# Altium schematic sheet power.SchDoc
size A4; DocumentNumber: 2; SheetNumber: 4; SheetTotal: 5
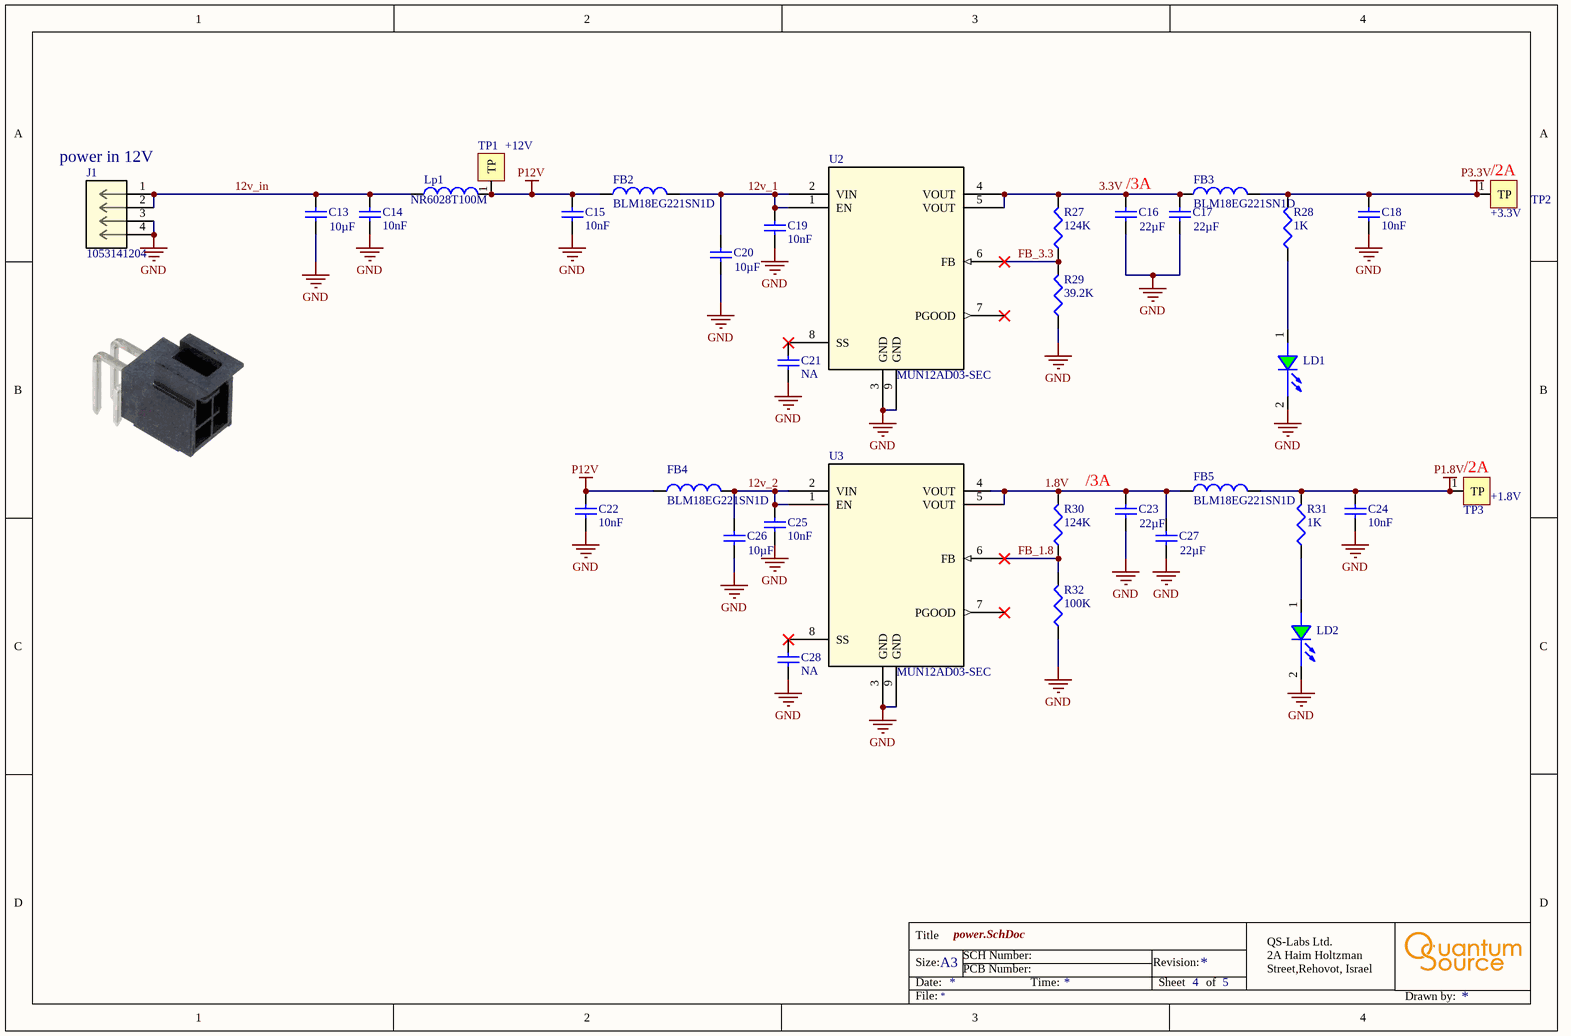
[diagram p0: power.SchDoc]

## Parts
C13  Capacitance: 10µF  [C0603]  (hidden comment: 10uF 25V)
C14  Capacitance: 10nF  [C0402]  (hidden comment: 10nF 25V)
C15  Capacitance: 10nF  [C0402]  (hidden comment: 10nF 25V)
C16  Capacitance: 22µF  [C0603]  (hidden comment: 22uF 16V)
C17  Capacitance: 22µF  [C0603]  (hidden comment: 22uF 16V)
C18  Capacitance: 10nF  [C0402]  (hidden comment: 10nF 25V)
C19  Capacitance: 10nF  [C0402]  (hidden comment: 10nF 25V)
C20  Capacitance: 10µF  [C0603]  (hidden comment: 10uF 25V)
C21  NA  [C0402]
C22  Capacitance: 10nF  [C0402]  (hidden comment: 10nF 25V)
C23  Capacitance: 22µF  [C0603]  (hidden comment: 22uF 16V)
C24  Capacitance: 10nF  [C0402]  (hidden comment: 10nF 25V)
C25  Capacitance: 10nF  [C0402]  (hidden comment: 10nF 25V)
C26  Capacitance: 10µF  [C0603]  (hidden comment: 10uF 25V)
C27  Capacitance: 22µF  [C0603]  (hidden comment: 22uF 16V)
C28  NA  [C0402]
FB2  BLM18EG221SN1D  [fb0603]
FB3  BLM18EG221SN1D  [FB0603]
FB4  BLM18EG221SN1D  [fb0603]
FB5  BLM18EG221SN1D  [fb0603]
J1  1053141204  [CON_1053141204]
LD1  APT1608SGC  [LED_0603_Green]  (value not drawn)
LD2  APT1608SGC  [LED_0603_Green]  (value not drawn)
Lp1  NR6028T100M  [ind6x6_H3]
R27  124K  [R0402]
R28  1K  [R0402]
R29  39.2K  [R0402]
R30  124K  [R0402]
R31  1K  [R0402]
R32  100K  [R0402]
TP1  +12V  [TP_2x1.8]
TP2  +3.3V  [TP_2x1.8]
TP3  +1.8V  [TP_2x1.8]
U2  MUN12AD03-SEC  [SO8_MUN12AD_DEA]
U3  MUN12AD03-SEC  [SO8_MUN12AD_DEA]

## Nets
GND: C13.1 C14.1 C15.1 C16.1 C17.1 C18.1 C19.1 C20.1 C21.1 C22.1 C23.1 C24.1 C25.1 C26.1 C27.1 C28.1 J1.3 J1.4 LD1.2(CATHODE) LD2.2(CATHODE) R29.1 R32.1 U2.3(GND) U2.9(GND) U3.3(GND) U3.9(GND)
P1.8V: C24.2 FB5.2 R31.2 TP3.1(TP)
P3.3V: C18.2 FB3.2 R28.2 TP2.1(TP)
P12V: C15.2 C22.2 FB2.1 FB4.1 Lp1.2 TP1.1(TP)
1.8V: C23.2 C27.2 FB5.1 R30.2 U3.4(VOUT) U3.5(VOUT)
3.3V: C16.2 C17.2 FB3.1 R27.2 U2.4(VOUT) U2.5(VOUT)
12v_1: C19.2 C20.2 FB2.2 U2.1(EN) U2.2(VIN)
12v_2: C25.2 C26.2 FB4.2 U3.1(EN) U3.2(VIN)
12v_in: C13.2 C14.2 J1.1 J1.2 Lp1.1
FB_1.8: R30.1 R32.2 U3.6(FB)
FB_3.3: R27.1 R29.2 U2.6(FB)
NetC21_2: C21.2 U2.8(SS)
NetC28_2: C28.2 U3.8(SS)
NetLD1_1: LD1.1(ANODE) R28.1
NetLD2_1: LD2.1(ANODE) R31.1

Not connected (* = marked no-connect by the designer): U2 7(PGOOD)*; U3 7(PGOOD)*

## Notes on the sheet
- (near J1) power in 12V
- (near TP2) /2A
- (near C16) /3A
- /3A
- (near TP3) /2A
- Title
- Size:
- Date:
- A3
- PCB Number:
- SCH Number:
- Time:
- Revision:
- Sheet
- of
- QS-Labs Ltd.
  2A Haim Holtzman Street,Rehovot, Israel
- File:
- Drawn by:

## Library data of the parts
C13 C20 C26 = CAP CER 10uF 10V 10% X5R 0603: CAP CER 10UF 25V 10% X5R 0603; Manufacturer Part Number: C1608X5R1A106K; Manufacturer: TDK Corporation; LANDA P/N: ECP-000008; Voltage - Rated: 10V; RoHS: RoHS Compliant; ComponentLink1URL: http://www.tdk.com/pdf/general_B11.pdf; ComponentLink1Description: http://www.tdk.com/pdf/general_B11.pdf; Package / Case: 0603 (1608 Metric)
C14 C15 C18 C19 C22 C24 C25 = CAP CER 12nF 25V 10% X7R 0402: CAP CER 10nF 25V 10% X5R 0402; Manufacturer Part Number: GRM155R71E123KA61D; Manufacturer: Murata Electronics North America; LANDA P/N: ECP-000042; RoHS: RoHS Compliant; Package / Case: 0402 (1005 Metric); ComponentLink1URL: http://search.murata.co.jp/Ceramy/image/img/PDF/ENG/GRM155R71E123KA61.pdf; ComponentLink1Description: http://search.murata.co.jp/Ceramy/image/img/PDF/ENG/GRM155R71E123KA61.pdf; Voltage - Rated: 25V
C16 C17 C23 C27 = CAP CER 10uF 10V 10% X5R 0603: CAP CER 22UF 16V 10% X5R 0603; Manufacturer Part Number: C1608X5R1A106K; Manufacturer: TDK Corporation; LANDA P/N: ECP-000008; Voltage - Rated: 10V; RoHS: RoHS Compliant; ComponentLink1URL: http://www.tdk.com/pdf/general_B11.pdf; ComponentLink1Description: http://www.tdk.com/pdf/general_B11.pdf; Package / Case: 0603 (1608 Metric)
C21 C28 = CAP CER 6.8pF 50V NP0 0402: CAP CER NA 50V NP0 0402; Manufacturer Part Number: C1005C0G1H6R8D; Manufacturer: TDK Corporation; LANDA P/N: ECP-000033; RoHS: RoHS Compliant; Package / Case: 0402 (1005 Metric); ComponentLink1URL: http://www.tdk.com/pdf/general_B11.pdf; ComponentLink1Description: http://www.tdk.com/pdf/general_B11.pdf; Voltage - Rated: 50V; Capacitance: NA
FB2-FB5 = BK1608HS600-T: FERRITE BEAD 220_OHM@100MHz 0603 2A 50mohm_DC; Manufacturer: Taiyo Yuden; LANDA P/N: EIN-000010; RoHS: RoHS Compliant; Package / Case: 0603 (1608 Metric); ComponentLink1URL: http://www.yuden.co.jp/ut/product/category/emisuppression/BK1608HS600-T.pdf; ComponentLink1Description: http://www.yuden.co.jp/ut/product/category/emisuppression/BK1608HS600-T.pdf; Manufacturer Part Number: BLM18EG221SN1D
J1 = 1053141204: No Description Available; Mfr_Name: Molex Connector Corporation; Copyright: Copyright (C) 2023 Ultra Librarian. All rights reserved.; Manufacturer_Part_Number: 1053141204; RefDes: RefDes; Type: DEV
LD1 LD2 = APT1608SGC: LED 1.6X0.8MM 568NM GRN CLR SMD; Manufacturer: Kingbright Corp; LANDA P/N: EDI-000006; RoHS: RoHS Compliant; Package / Case: 0603 (1608 Metric); ComponentLink1URL: http://www.us.kingbright.com/images/catalog/SPEC/APT1608SGC.pdf; ComponentLink1Description: http://www.us.kingbright.com/images/catalog/SPEC/APT1608SGC.pdf; Manufacturer Part Number: APT1608SGC
Lp1 = NR6028T100M: INDUCTOR 10UH 1.9A 20% SMD; Manufacturer: Taiyo Yuden; Shielding: Shielded; LANDA P/N: EIN-000003; Package / Case: Non Standard; Size / Dimension: 0.236" L x 0.236" W x 0.110" H (6.00mm x 6.00mm x 2.80mm); RoHS: RoHS Compliant; ComponentLink1URL: http://www.yuden.co.jp/ut/product/category/inductor/NR6028T100M.pdf; ComponentLink1Description: http://www.yuden.co.jp/ut/product/category/inductor/NR6028T100M.pdf; Manufacturer Part Number: NR6028T100M
R27 R30 = RES 15.4K OHM 1/10W 1% 0402 SMD: RES 124K OHM 1/10W 1% 0402 SMD; Manufacturer: Panasonic Electronic Components; Manufacturer Part Number: ERJ-2RKF1542X; Power (Watts): 0.1W, 1/10W; LANDA P/N: ERS-000060; Package / Case: 0402 (1005 Metric); Supplier Device Package: 0402; RoHS: RoHS Compliant; ComponentLink1URL: http://industrial.panasonic.com/www-cgi/jvcr13pz.cgi?E+PZ+3+AOA0002+ERJ2RKF1542X+7+WW; ComponentLink1Description: http://industrial.panasonic.com/www-cgi/jvcr13pz.cgi?E+PZ+3+AOA0002+ERJ2RKF1542X+7+WW
R28 R31 = RES 3.09K OHM 1/16W 1% 0402: RES 1K OHM 1/16W 1% 0402; Manufacturer Part Number: RMCF0402FT3K09; Manufacturer: Stackpole Electronics Inc; Power (Watts): 0.063W, 1/16W; LANDA P/N: ERS-000063; Supplier Device Package: 0402; Package / Case: 0402 (1005 Metric); RoHS: RoHS Compliant; ComponentLink1URL: http://www.seielect.com/Catalog/SEI-RMCF_RMCP.pdf; ComponentLink1Description: http://www.seielect.com/Catalog/SEI-RMCF_RMCP.pdf
R29 = RES 15.4K OHM 1/10W 1% 0402 SMD: RES 39.2K OHM 1/10W 1% 0402 SMD; Manufacturer: Panasonic Electronic Components; Manufacturer Part Number: ERJ-2RKF1542X; Power (Watts): 0.1W, 1/10W; LANDA P/N: ERS-000060; Package / Case: 0402 (1005 Metric); Supplier Device Package: 0402; RoHS: RoHS Compliant; ComponentLink1URL: http://industrial.panasonic.com/www-cgi/jvcr13pz.cgi?E+PZ+3+AOA0002+ERJ2RKF1542X+7+WW; ComponentLink1Description: http://industrial.panasonic.com/www-cgi/jvcr13pz.cgi?E+PZ+3+AOA0002+ERJ2RKF1542X+7+WW
R32 = RES 3.09K OHM 1/16W 1% 0402: RES 100K OHM 1/16W 1% 0402; Manufacturer Part Number: RMCF0402FT3K09; Manufacturer: Stackpole Electronics Inc; Power (Watts): 0.063W, 1/16W; LANDA P/N: ERS-000063; Supplier Device Package: 0402; Package / Case: 0402 (1005 Metric); RoHS: RoHS Compliant; ComponentLink1URL: http://www.seielect.com/Catalog/SEI-RMCF_RMCP.pdf; ComponentLink1Description: http://www.seielect.com/Catalog/SEI-RMCF_RMCP.pdf
TP1-TP3 = TP mini_2: TP PC MINIATURE SMT; Manufacturer: Keystone Electronics; Manufacturer Part Number: 5015; Assembly: N.A; LANDA P/N: ECN-000032; RoHS: RoHS Compliant
U2 U3 = MUN12AD03-SEC: No Description Available; Mfr_Name: Delta; Type: DEV; Copyright: Copyright (C) 2023 Ultra Librarian. All rights reserved.; Manufacturer_Part_Number: MUN12AD03-SEC; RefDes: RefDes